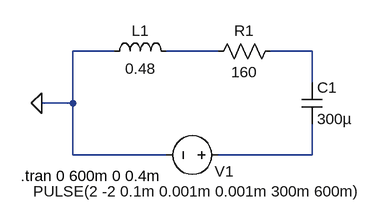
[diagram p0: schematic lab2-4.asc]
lab2-4.asc, the LTspice schematic file:
Version 4
SHEET 1 936 968
WIRE 288 240 224 240
WIRE 448 240 368 240
WIRE 592 240 528 240
WIRE 592 288 592 240
WIRE 224 320 224 240
WIRE 224 320 176 320
WIRE 224 400 224 320
WIRE 368 400 224 400
WIRE 592 400 592 352
WIRE 592 400 448 400
FLAG 176 320 0
SYMBOL res 544 224 R90
WINDOW 0 0 56 VBottom 2
WINDOW 3 32 56 VTop 2
SYMATTR InstName R1
SYMATTR Value 160
SYMBOL voltage 464 400 R90
WINDOW 123 0 0 Left 0
WINDOW 39 0 0 Left 0
WINDOW 0 25 -8 VRight 2
WINDOW 3 56 -207 VRight 2
SYMATTR InstName V1
SYMATTR Value PULSE(2 -2 0.1m 0.001m 0.001m 300m 600m)
SYMBOL ind 272 256 R270
WINDOW 0 32 56 VTop 2
WINDOW 3 5 56 VBottom 2
SYMATTR InstName L1
SYMATTR Value 0.48
SYMBOL cap 576 288 R0
SYMATTR InstName C1
SYMATTR Value 300µ
TEXT 144 432 Left 2 !.tran 0 600m 0 0.4m

The netlist it stands for:
* lab2-4.asc
R1 N002 N001 160
V1 N003 0 PULSE(2 -2 0.1m 0.001m 0.001m 300m 600m)
L1 0 N001 0.48
C1 N002 N003 300µ
.tran 0 600m 0 0.4m
.backanno
.end